# EAGLE design 3channeldimmer (EAGLE 5.06)
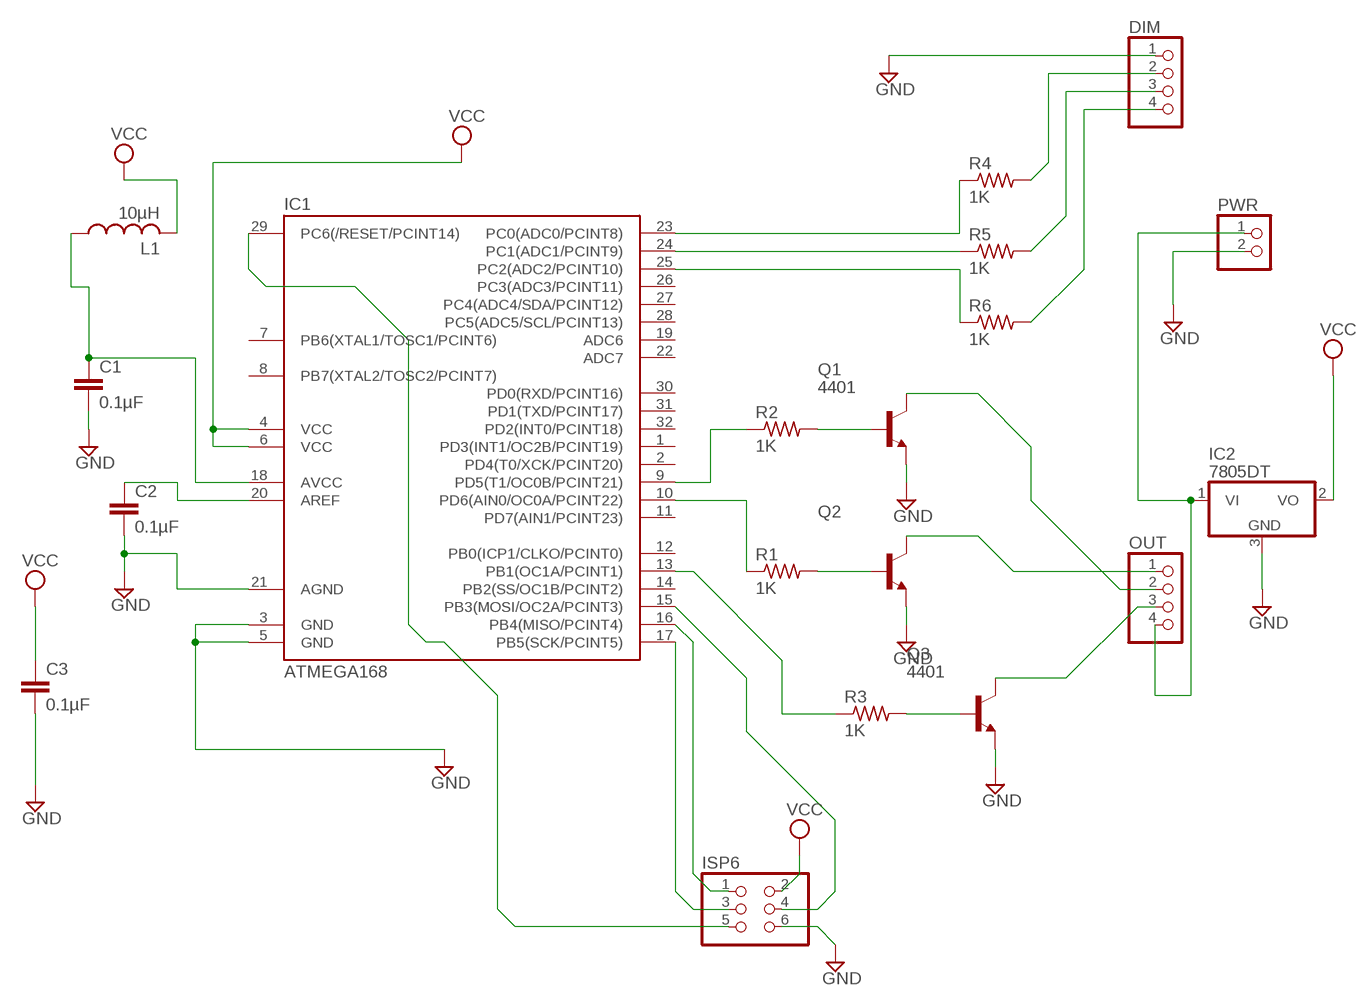
[diagram p0: schematic, sheet 1]

## Parts
C1  0.1µF  C-EUC0805  [C0805]
C2  0.1µF  C-EUC0805  [C0805]
C3  0.1µF  C-EUC0805  [C0805]
DIM  PINHD-1X4  [1X04]
IC1  ATMEGA168  ATMEGA48/88/168-AU  [TQFP32-08]
IC2  7805DT  [TO252]
ISP6  PINHD-2X3  [2X03]
L1  10µH  L-US0207/15  [0207/15]
OUT  PINHD-1X4  [1X04]
PWR  PINHD-1X2  [1X02]
Q1  4401  MMBT4401LT1-NPN-SOT23-BEC  [SOT23-BEC]
Q2  MMBT4401LT1-NPN-SOT23-BEC  [SOT23-BEC]
Q3  4401  MMBT4401LT1-NPN-SOT23-BEC  [SOT23-BEC]
R1  1K  R-US_M0805  [M0805]
R2  1K  R-US_M0805  [M0805]
R3  1K  R-US_M0805  [M0805]
R4  1K  R-US_M0805  [M0805]
R5  1K  R-US_M0805  [M0805]
R6  1K  R-US_M0805  [M0805]

## Nets
B: OUT.3 Q3.C
G: OUT.2 Q1.C
GND: C1.2 C2.2 C3.2 DIM.1 IC1.3(GND) IC1.5(GND) IC1.21(AGND) IC2.3(GND) ISP6.6 PWR.2 Q1.E Q2.E Q3.E
N$1: IC1.23(PC0(ADC0/PCINT8)) R4.1
N$2: IC1.24(PC1(ADC1/PCINT9)) R5.1
N$3: IC1.25(PC2(ADC2/PCINT10)) R6.1
N$4: DIM.2 R4.2
N$5: IC1.17(PB5(SCK/PCINT5)) ISP6.3
N$6: DIM.3 R5.2
N$7: IC1.10(PD6(AIN0/OC0A/PCINT22)) R1.1
N$8: IC1.9(PD5(T1/OC0B/PCINT21)) R2.1
N$9: IC1.13(PB1(OC1A/PCINT1)) R3.1
N$10: Q1.B R2.2
N$11: Q2.B R1.2
N$12: Q3.B R3.2
N$13: DIM.4 R6.2
N$16: IC2.1(VI) OUT.4 PWR.1
N$17: C1.1 IC1.18(AVCC) L1.1
N$19: IC1.16(PB4(MISO/PCINT4)) ISP6.1
N$20: IC1.15(PB3(MOSI/OC2A/PCINT3)) ISP6.4
N$21: C2.1 IC1.20(AREF)
N$22: IC1.29(PC6(/RESET/PCINT14)) ISP6.5
R: OUT.1 Q2.C
VCC: C3.1 IC1.4(VCC) IC1.6(VCC) IC2.2(VO) ISP6.2 L1.2
Unconnected: IC1.1(PD3(INT1/OC2B/PCINT19)) IC1.2(PD4(T0/XCK/PCINT20)) IC1.7(PB6(XTAL1/TOSC1/PCINT6)) IC1.8(PB7(XTAL2/TOSC2/PCINT7)) IC1.11(PD7(AIN1/PCINT23)) IC1.12(PB0(ICP1/CLKO/PCINT0)) IC1.14(PB2(SS/OC1B/PCINT2)) IC1.19(ADC6) IC1.22(ADC7) IC1.26(PC3(ADC3/PCINT11)) IC1.27(PC4(ADC4/SDA/PCINT12)) IC1.28(PC5(ADC5/SCL/PCINT13)) IC1.30(PD0(RXD/PCINT16)) IC1.31(PD1(TXD/PCINT17)) IC1.32(PD2(INT0/PCINT18))

## Library data of the parts
C1-C3 = resistor:C-EU: CAPACITOR, European symbol
DIM OUT = pinhead:PINHD-1X4: PIN HEADER
IC1 = atmega8:ATMEGA48/88/168
IC2 = linear:78*: Positive VOLTAGE REGULATOR Source: http://cache.national.com/ds/LM/LM78L05.pdf http://www.fairchildsemi.com/ds/LM/LM7805.pdf
ISP6 = pinhead:PINHD-2X3: PIN HEADER
L1 = rcl:L-US: INDUCTOR, American symbol
PWR = pinhead:PINHD-1X2: PIN HEADER
Q1 = transistor-neu-to92:*-NPN-: NPN Transistror BF959 corrected 2008.03.06
Q2 Q3 = transistor:*-NPN-: NPN Transistror BF959 corrected 2008.03.06
R1-R6 = rcl:R-US_: RESISTOR, American symbol

## Board
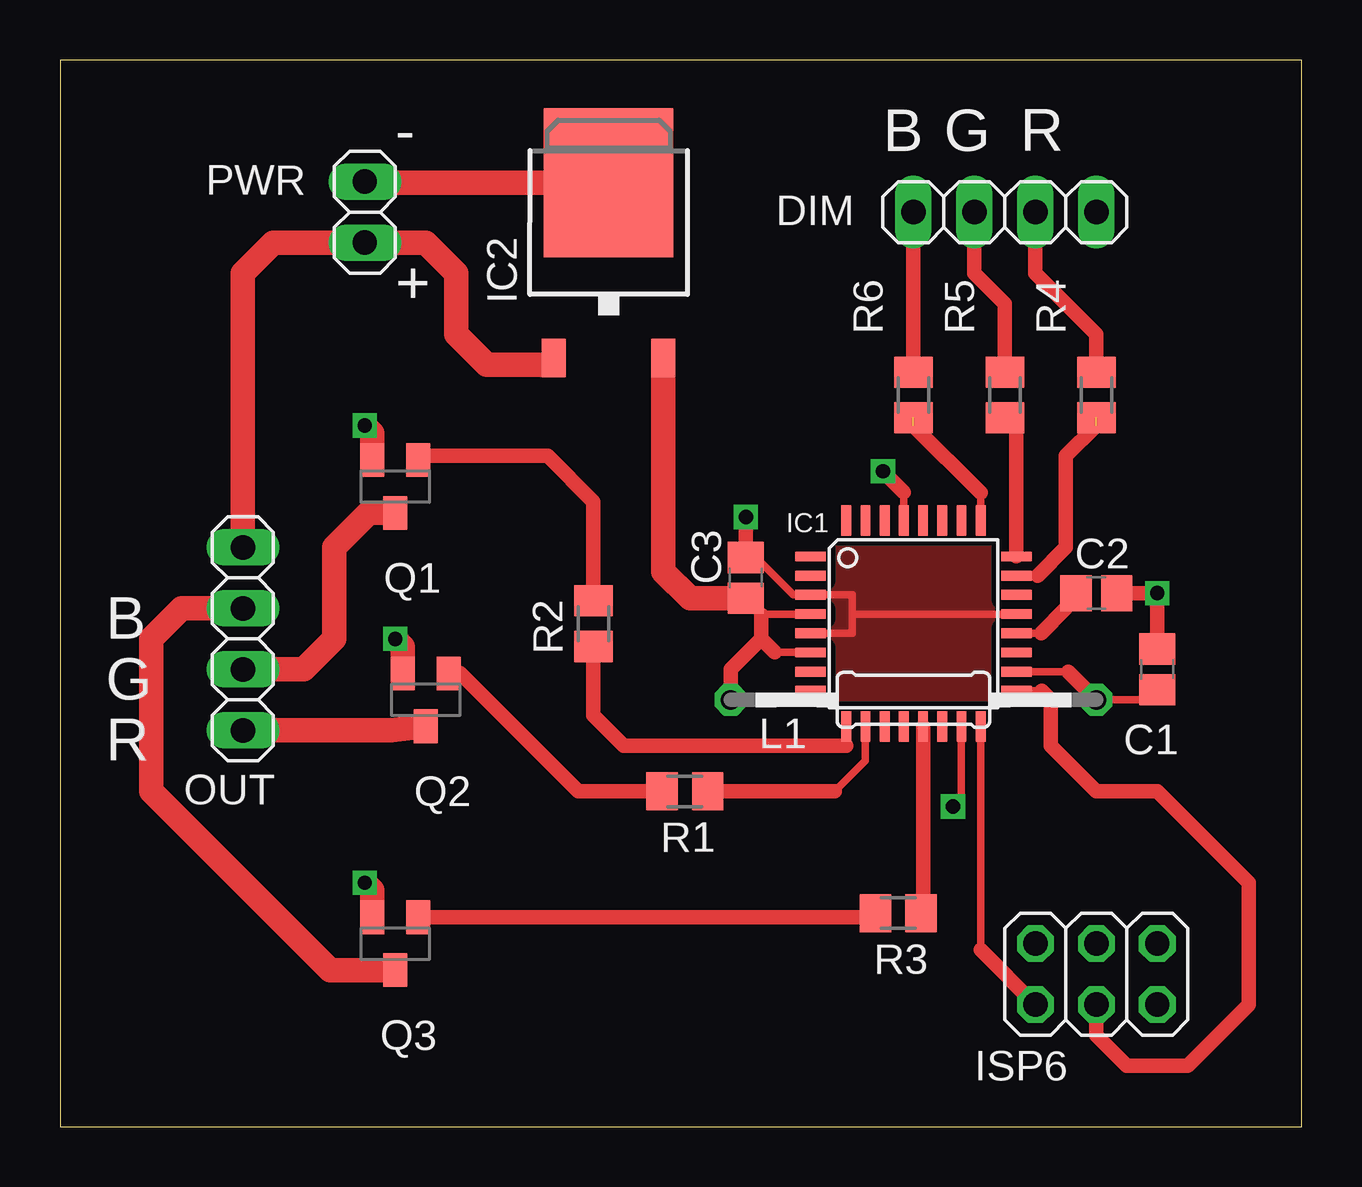
[diagram p1: board, top side]
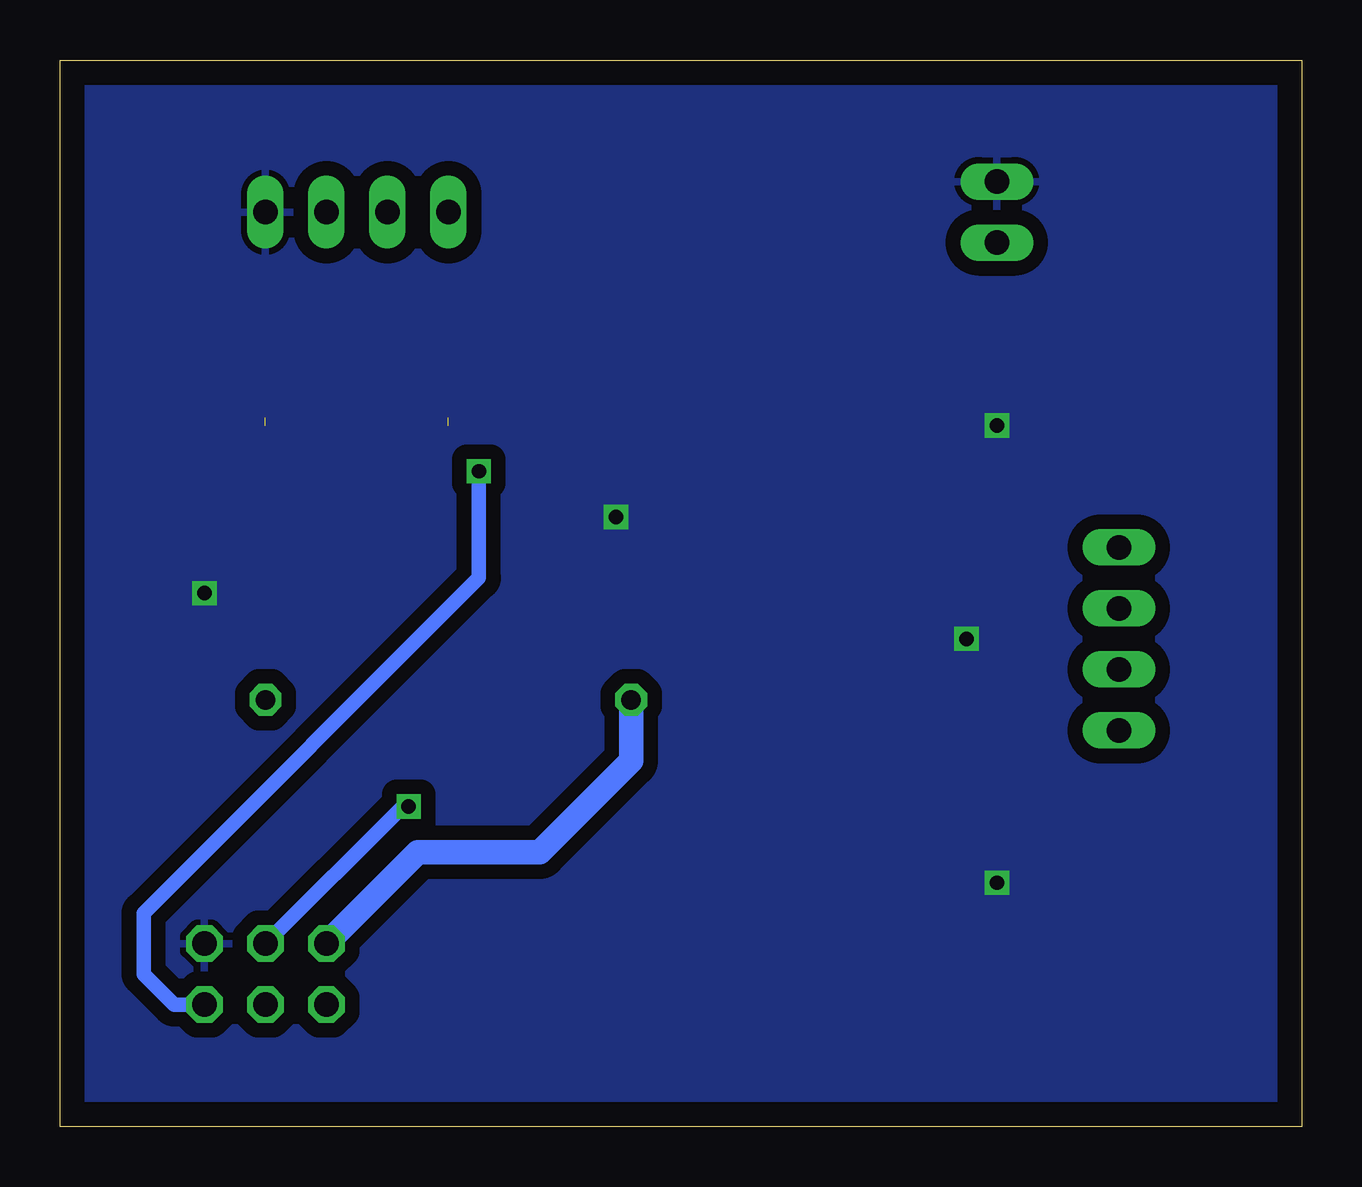
[diagram p2: board, bottom side, seen from below]

Size 51.74 x 44.44 mm. Coordinates in mm from the lower left corner, seen from the top.
Outline: 0,0 51.74,0 51.74,44.44 0,44.44 0,0
Copper layers (1*16): Top 0.035mm / dielectric 1.5mm / Bottom 0.035mm
Design rules "default": minimum track width 10mil, minimum drill 24mil, track to track 8mil, track to pad 8mil, pad to pad 8mil, via to via 8mil, smd to smd 8mil, copper to edge 40mil, drill to drill 8mil, minimum pad ring 10mil, minimum via ring 8mil, stop-mask expansion 4mil, vias tented up to drill 0mil, thermal gap 10mil

### Footprints (pad centres in the part's own frame; a part is rotated, then mirrored left to right if it is on the bottom)
C0805 = smd 1.3 x 1.5: 1 -0.85,0; 2 0.85,0
1X04 = drill 1.016 long: 1 -3.81,0; 2 -1.27,0; 3 1.27,0; 4 3.81,0
TQFP32-08 = smd 1.27 x 0.406: 1 -4.293,2.8; 2 -4.293,2; 3 -4.293,1.2; 4 -4.293,0.4; 5 -4.293,-0.4; 6 -4.293,-1.2; 7 -4.293,-2; 8 -4.293,-2.8; 17 4.293,-2.8; 18 4.293,-2; 19 4.293,-1.2; 20 4.293,-0.4; 21 4.293,0.4; 22 4.293,1.2; 23 4.293,2; 24 4.293,2.8 | smd 0.406 x 1.27: 9 -2.8,-4.293; 10 -2,-4.293; 11 -1.2,-4.293; 12 -0.4,-4.293; 13 0.4,-4.293; 14 1.2,-4.293; 15 2,-4.293; 16 2.8,-4.293; 25 2.8,4.293; 26 2,4.293; 27 1.2,4.293; 28 0.4,4.293; 29 -0.4,4.293; 30 -1.2,4.293; 31 -2,4.293; 32 -2.8,4.293
TO252 = smd 1 x 1.6: 1 -2.28,-4.8; 2 2.28,-4.8 | smd 5.4 x 6.2: 3 0,2.5
2X03 = drill 1.016 octagon: 1 -2.54,-1.27; 2 -2.54,1.27; 3 0,-1.27; 4 0,1.27; 5 2.54,-1.27; 6 2.54,1.27
0207/15 = drill 0.813 octagon: 1 -7.62,0; 2 7.62,0
1X02 = drill 1.016 long: 1 -1.27,0; 2 1.27,0
SOT23-BEC = smd 1 x 1.4: B -0.95,-1.1; C 0,1.1; E 0.95,-1.1
M0805 = smd 1.3 x 1.6: 1 -0.95,0; 2 0.95,0

### Placement (x,y rotation side)
C1  45.72,19.05 90 top
C2  43.18,22.23 0 top
C3  28.57,22.86 90 top
DIM  39.37,38.1 180 top
IC1  35.56,20.95 0 top
IC2  22.86,36.83 0 top
ISP6  43.18,6.35 0 top
L1  35.56,17.78 180 top
OUT  7.62,20.32 90 top
PWR  12.7,38.1 90 top
Q1  13.97,26.67 180 top
Q2  15.24,17.78 180 top
Q3  13.97,7.62 180 top
R1  26.04,13.97 180 top
R2  22.23,20.95 90 top
R3  34.92,8.89 180 top
R4  43.18,30.48 90 top
R5  39.37,30.48 90 top
R6  35.56,30.48 90 top

### Tracks (layer width: path | path; a pad name or v marks a point on that pad's centre or on a via)
B
  Top 1.016: OUT.3 5.08,21.59 3.81,20.32 3.81,13.97 11.26,6.52 Q3.C
G
  Top 1.016: OUT.2 10.16,19.05 11.43,20.32 11.43,24.13 12.87,25.57 Q1.C
GND  (via drill 0.6)
  Top 0.305: 33.02,22.16 IC1.3 30.55,22.16 29.21,23.5 28.79,23.5 C3.2 | 33.02,22.16 33.02,20.55 IC1.5 | 33.02,22.16 33.02,21.36 IC1.21
  Top 0.406: 22.86,39.37 IC2.3 24.13,39.33 24.13,36.83
  Top 0.61: C3.2 v28.57,25.4 | C1.2 v45.72,22.23 C2.2
  Top 1.016: Q3.E 13.02,9.84 v12.7,10.16 | Q2.E 14.29,20 v13.97,20.32 | Q1.E 13.02,28.89 v12.7,29.21 | IC2.3 12.74,39.33 PWR.2
  pour Bottom (isolate 0.61): 0,44.45 52.07,44.45 52.07,0 0,0
  pour Top (isolate 0.406): 31.75,24.13 39.37,24.13 39.37,17.78 31.75,17.78
N$1  (1 unrouted)
  Top 0.305: IC1.23 40.73,22.95
  Top 0.61: 40.73,22.95 41.91,24.13 41.91,27.94 43.18,29.21
N$2
  Top 0.305: 39.85,29.05 R5.1
  Top 0.61: IC1.24 39.85,29.05
N$3  (1 unrouted)
  Top 0.305: IC1.25 38.36,26.41
  Top 0.61: 38.36,26.41 35.56,29.21
N$4
  Top 0.61: DIM.2 40.64,35.56 43.18,33.02 R4.2
N$5
  Top 0.305: 40.9,18.16 IC1.17
  Top 0.61: 40.9,18.16 41.27,17.78 41.27,15.88 43.18,13.97 45.72,13.97 49.53,10.16 49.53,5.08 46.99,2.54 44.45,2.54 43.18,3.81 ISP6.3
N$6
  Top 0.61: R5.2 39.37,34.29 38.1,35.56 DIM.3
N$7
  Top 0.305: IC1.10 33.56,15.24 32.29,13.97
  Top 0.61: R1.1 32.29,13.97
N$8
  Top 0.406: 32.76,15.88 IC1.9
  Top 0.61: 32.76,15.88 23.5,15.88 22.23,17.14 R2.1
N$9
  Top 0.406: R3.1 35.96,8.89
  Top 0.61: 35.96,8.89 IC1.13
N$10
  Top 0.61: R2.2 22.23,26.04 20.32,27.94 15.09,27.94 Q1.B
N$11
  Top 0.61: R1.2 21.59,13.97 16.68,18.88 Q2.B
N$12
  Top 0.406: 33.98,8.72 R3.2
  Top 0.61: Q3.B 33.98,8.72
N$13
  Top 0.61: R6.2 DIM.4
N$16
  Top 0.406: 20.58,31.75 IC2.1 20.32,32.03 20.32,31.75 20.58,31.75
  Top 1.016: 20.32,31.75 17.78,31.75 16.51,33.02 16.51,35.56 15.24,36.83 PWR.1 8.89,36.83 7.62,35.56 OUT.4
N$17
  Top 0.305: IC1.18 42.01,18.95 | C1.1 45.3,17.78 L1.1
  Top 0.61: 42.01,18.95 L1.1
N$19
  Top 0.305: 38.36,7.36 IC1.16
  Top 0.61: 38.36,7.36 ISP6.1
N$20  (via drill 0.6)
  Top 0.305: v37.21,13.34 37.56,13.68 IC1.15
  Bottom 0.305: v37.21,13.34 37.47,13.34
  Bottom 0.61: 37.47,13.34 ISP6.4
N$21
  Top 0.305: IC1.20 40.88,20.55 | 41.91,21.59 41.91,21.8 C2.1
  Top 0.61: 40.88,20.55 41.91,21.59
N$22  (via drill 0.6)
  Top 0.305: 35.16,26.43 IC1.29
  Top 0.61: v34.29,27.3 35.16,26.43
  Bottom 0.61: ISP6.5 46.99,5.08 48.26,6.35 48.26,8.89 34.29,22.86 v34.29,27.3
R
  Top 1.016: Q2.C 13.8,16.51 OUT.1
VCC
  Top 0.305: 29.23,21.36 IC1.4 | 29.23,21.36 C3.1 | 29.21,21.34 29.23,21.36 | 29.77,19.75 IC1.6
  Top 0.61: 29.21,20.32 29.21,21.34 | 29.21,20.32 29.77,19.75 | L1.2 27.94,19.05 29.21,20.32
  Top 1.016: IC2.2 25.14,23.12 26.25,22.01 C3.1
  Bottom 1.016: ISP6.2 36.83,11.43 31.75,11.43 27.94,15.24 L1.2

### Text on the board
tNames: - | B | G | R | + | B | G | R